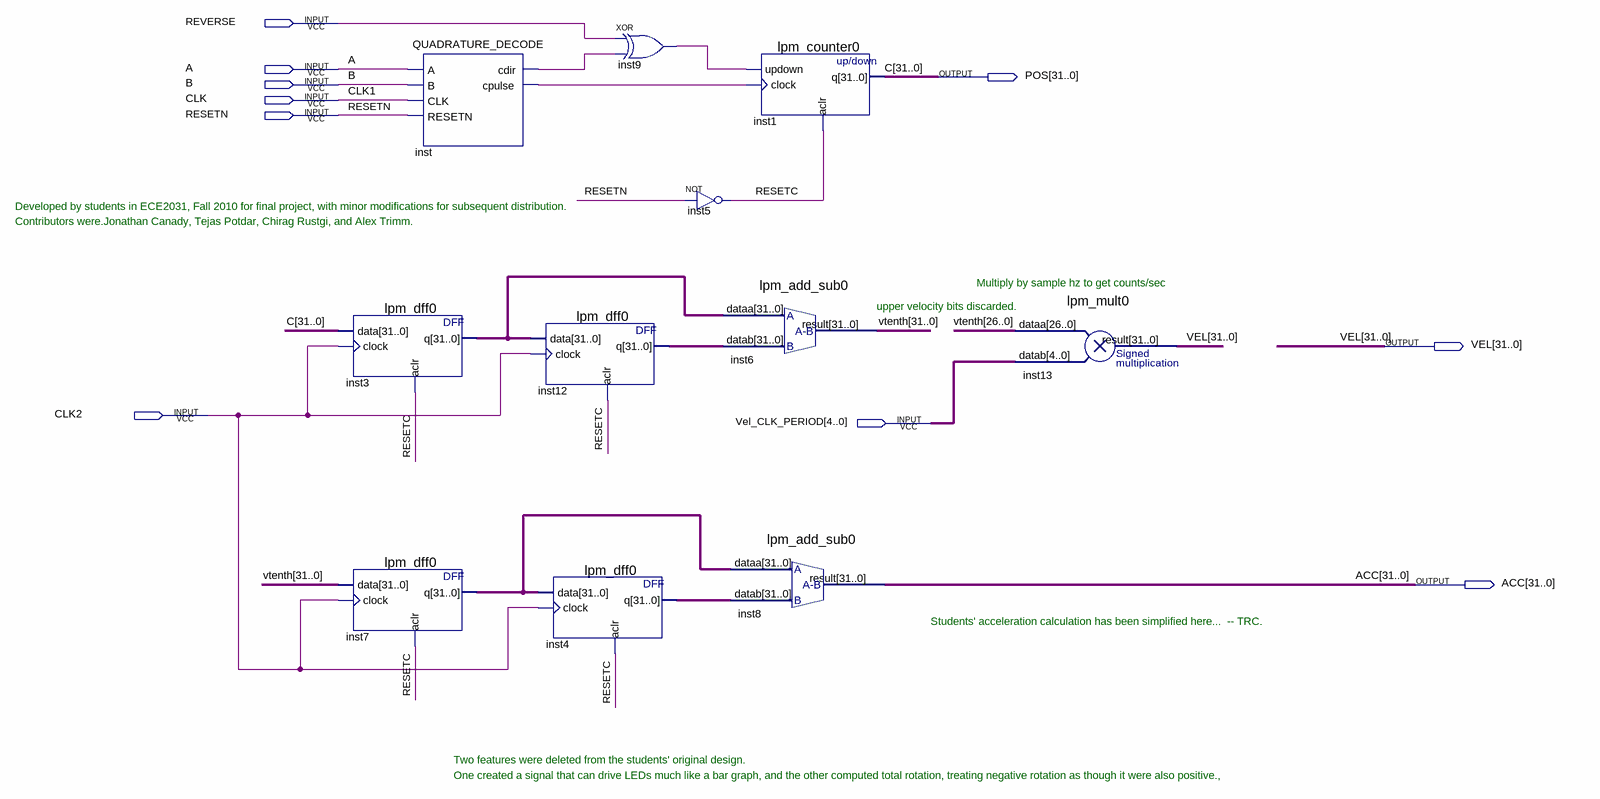
[diagram p0: schematic sheet]
// Quartus schematic POSN_VEL.bdf as structural Verilog: 11 symbols, 10 pins
module POSN_VEL (
  input  REVERSE,
  input  A,
  input  B,
  input  CLK,
  input  RESETN,
  input  CLK2,
  input  [4:0] Vel_CLK_PERIOD,
  output [31:0] POS,
  output [31:0] VEL,
  output [31:0] ACC
);

  wire inst9_out, inst_cdir, inst_cpulse, RESETC;
  wire [31:0] inst3_q, inst4_q, inst7_q, inst12_q, vtenth;

  lpm_dff0 inst3 (.data(POS), .clock(CLK2), .aclr(RESETC), .q(inst3_q));
  lpm_dff0 inst7 (.data(vtenth), .clock(CLK2), .aclr(RESETC), .q(inst7_q));
  QUADRATURE_DECODE inst (.A(A), .B(B), .CLK(CLK), .RESETN(RESETN), .cpulse(inst_cpulse), .cdir(inst_cdir));
  lpm_dff0 inst12 (.data(inst3_q), .clock(CLK2), .aclr(RESETC), .q(inst12_q));
  lpm_dff0 inst4 (.data(inst7_q), .clock(CLK2), .aclr(RESETC), .q(inst4_q));
  xor inst9 (inst9_out, REVERSE, inst_cdir);
  not inst5 (RESETC, RESETN);
  lpm_add_sub0 inst6 (.dataa(inst3_q), .datab(inst12_q), .result(vtenth));
  lpm_add_sub0 inst8 (.dataa(inst7_q), .datab(inst4_q), .result(ACC));
  lpm_counter0 inst1 (.updown(inst9_out), .clock(inst_cpulse), .aclr(RESETC), .q(POS));
  lpm_mult0 inst13 (.dataa(vtenth[26:0]), .datab(Vel_CLK_PERIOD), .result(VEL));

  // Other names for the same wires on the sheet: C[31:0] = POS; CLK1 = CLK

  // Notes on the sheet:
  //   Developed by students in ECE2031, Fall 2010 for final project, with minor modifications for subsequent distribution.
  //   Contributors were.Jonathan Canady, Tejas Potdar, Chirag Rustgi, and Alex Trimm.
  //   Multiply by sample hz to get counts/sec
  //   upper velocity bits discarded.
  //   Students' acceleration calculation has been simplified here...  -- TRC.
  //   Two features were deleted from the students' original design.
  //   One created a signal that can drive LEDs much like a bar graph, and the other computed total rotation, treating negative rotation as though it were also positive.,
endmodule
